# Altium schematic sheet P01 Note & Title.SchDoc
size 420 x 297 mm
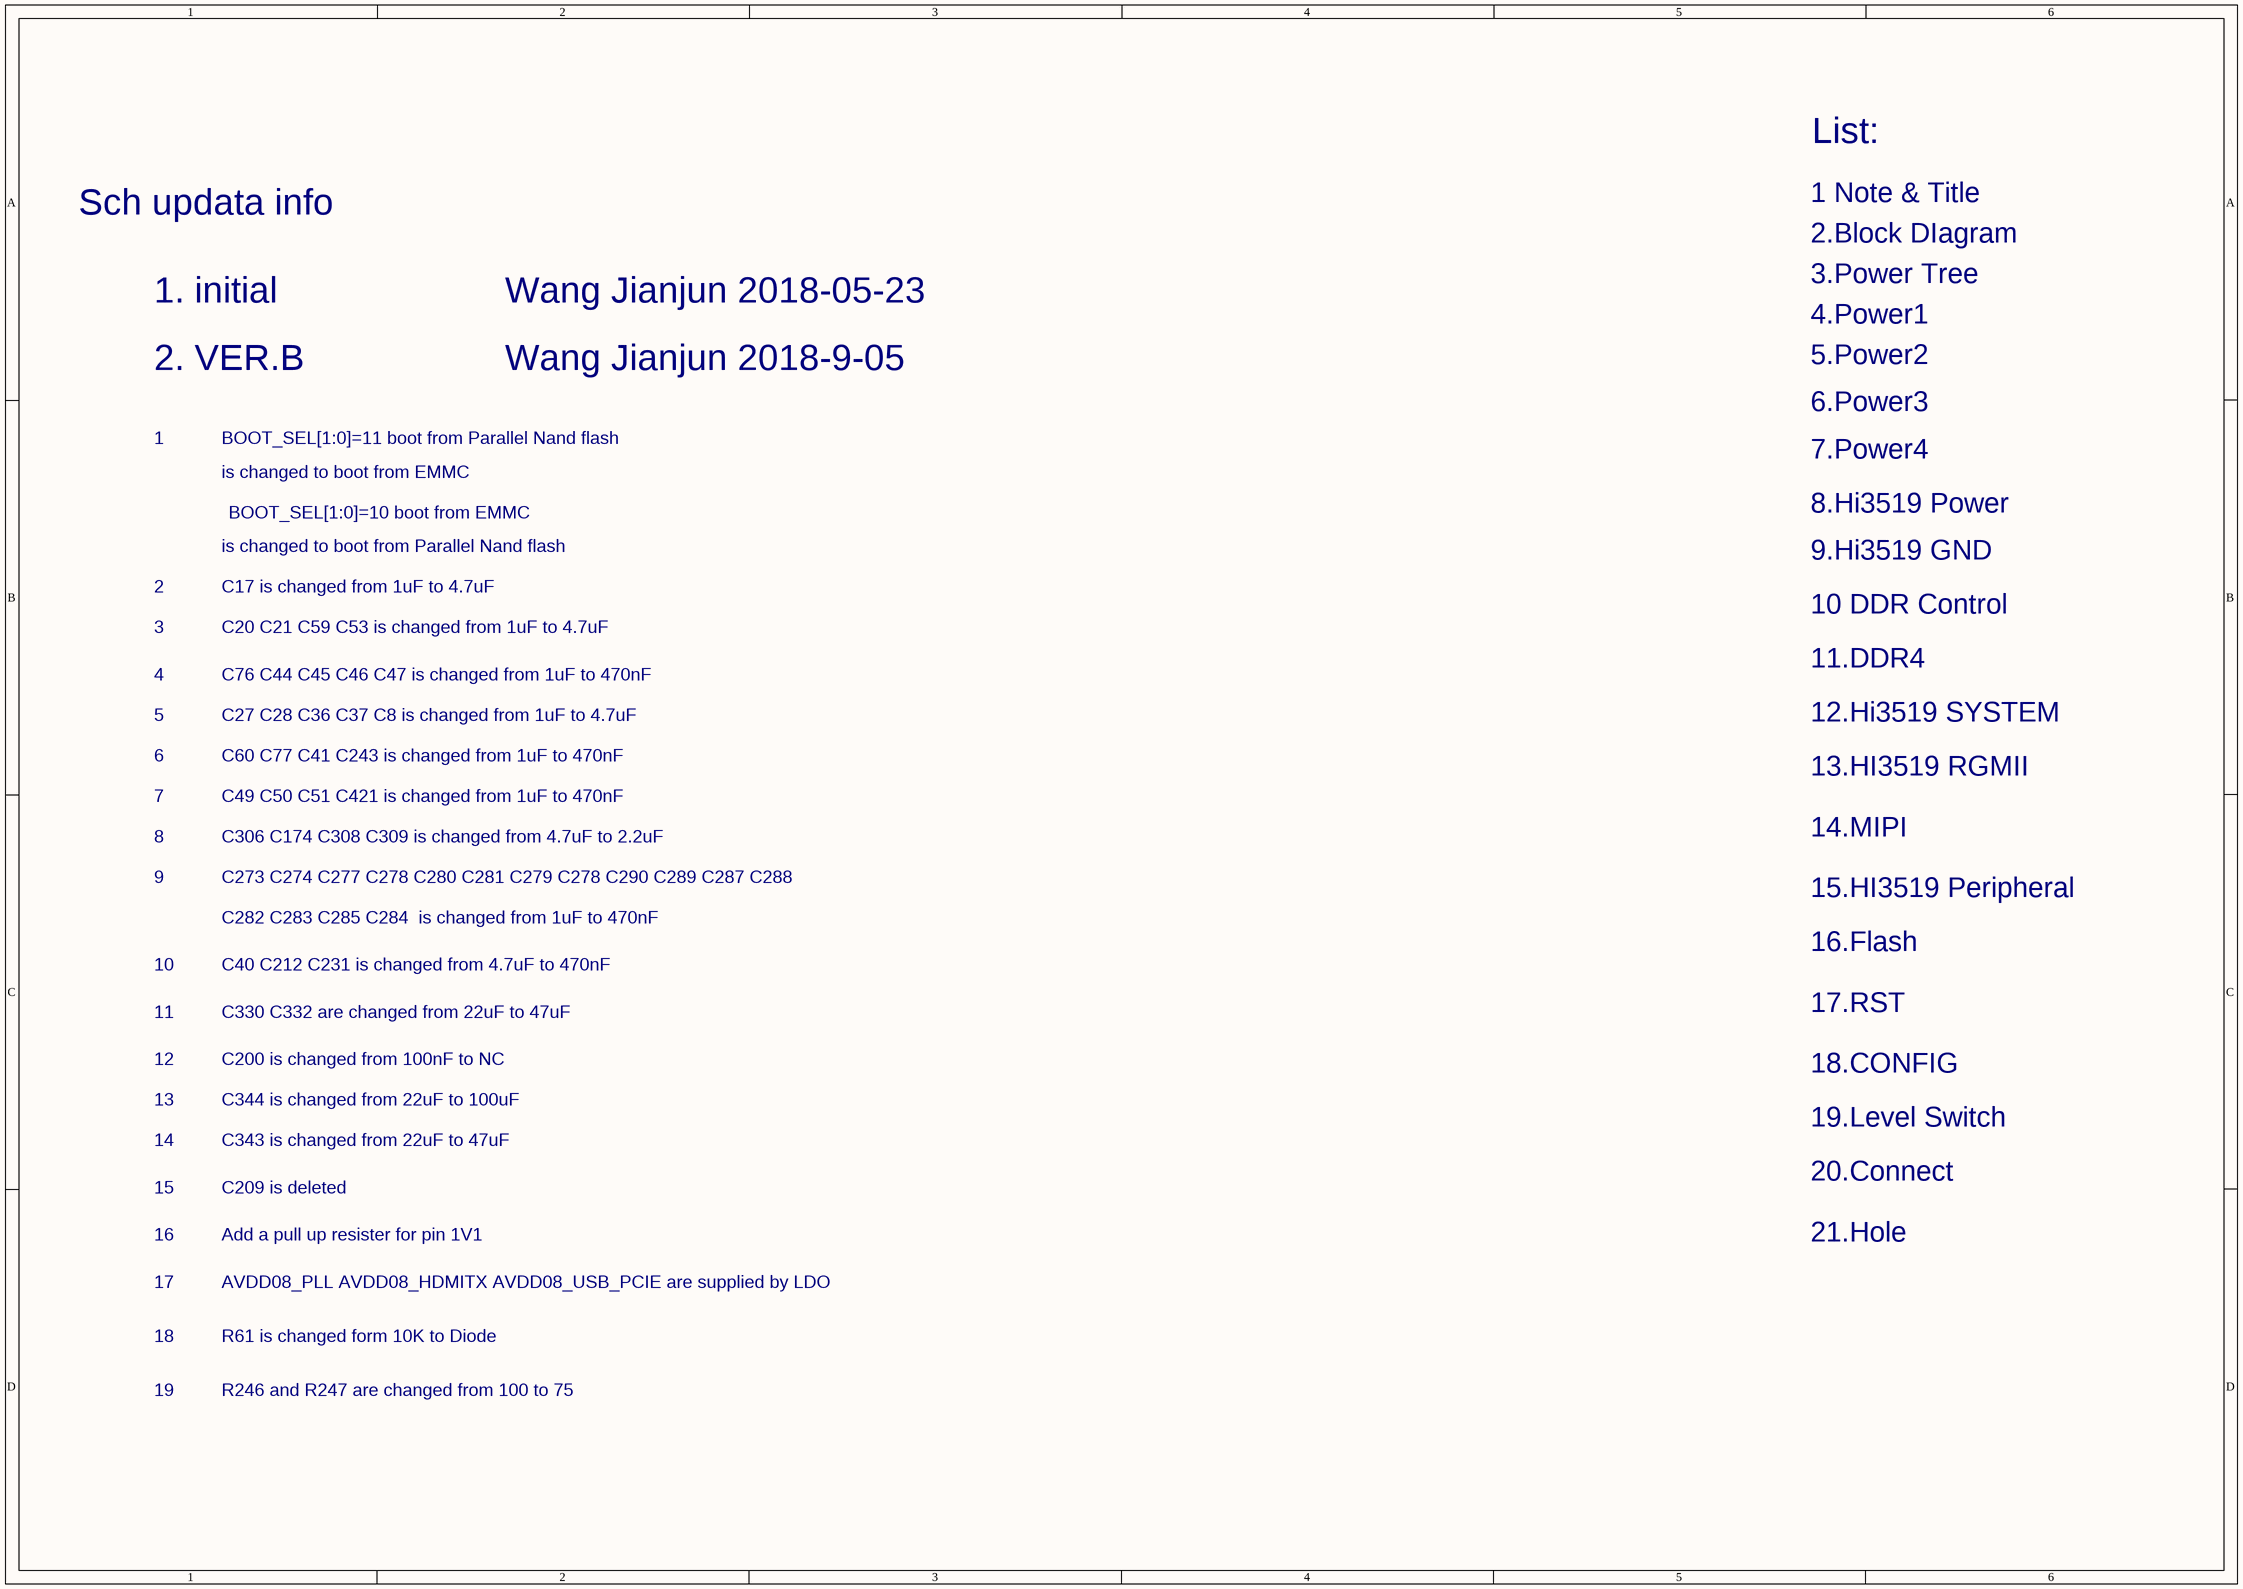
[diagram p0: P01 Note & Title.SchDoc]

## Notes on the sheet
- List:
- Sch updata info
- 1 Note & Title
- 2.Block DIagram
- 1. initial
- Wang Jianjun 2018-05-23
- 3.Power Tree
- 4.Power1
- 2. VER.B
- Wang Jianjun 2018-9-05
- 5.Power2
- 1
- BOOT_SEL[1:0]=11 boot from Parallel Nand flash
- 6.Power3
- 7.Power4
- is changed to boot from EMMC
- BOOT_SEL[1:0]=10 boot from EMMC
- 8.Hi3519 Power
- 2
- C17 is changed from 1uF to 4.7uF
- is changed to boot from Parallel Nand flash
- 9.Hi3519 GND
- 3
- C20 C21 C59 C53 is changed from 1uF to 4.7uF
- 10 DDR Control
- 5
- 4
- C27 C28 C36 C37 C8 is changed from 1uF to 4.7uF
- C76 C44 C45 C46 C47 is changed from 1uF to 470nF
- 12.Hi3519 SYSTEM
- 11.DDR4
- 7
- 6
- C49 C50 C51 C421 is changed from 1uF to 470nF
- C60 C77 C41 C243 is changed from 1uF to 470nF
- 13.HI3519 RGMII
- 8
- C306 C174 C308 C309 is changed from 4.7uF to 2.2uF
- 14.MIPI
- 9
- C282 C283 C285 C284  is changed from 1uF to 470nF
- C273 C274 C277 C278 C280 C281 C279 C278 C290 C289 C287 C288
- 15.HI3519 Peripheral
- 10
- C40 C212 C231 is changed from 4.7uF to 470nF
- 16.Flash
- 12
- 11
- C200 is changed from 100nF to NC
- C330 C332 are changed from 22uF to 47uF
- 17.RST
- 13
- C344 is changed from 22uF to 100uF
- 19.Level Switch
- 18.CONFIG
- 15
- 14
- C209 is deleted
- C343 is changed from 22uF to 47uF
- 20.Connect
- 16
- Add a pull up resister for pin 1V1
- 21.Hole
- 17
- 18
- AVDD08_PLL AVDD08_HDMITX AVDD08_USB_PCIE are supplied by LDO
- R61 is changed form 10K to Diode
- 19
- R246 and R247 are changed from 100 to 75